# EasyEDA schematic Industrial project work circuits.json
TITLE: Rotary Encoder; REV: 1.0; Date: 2019-01-08; Sheet: 1/1; Drawn By: petrvavra
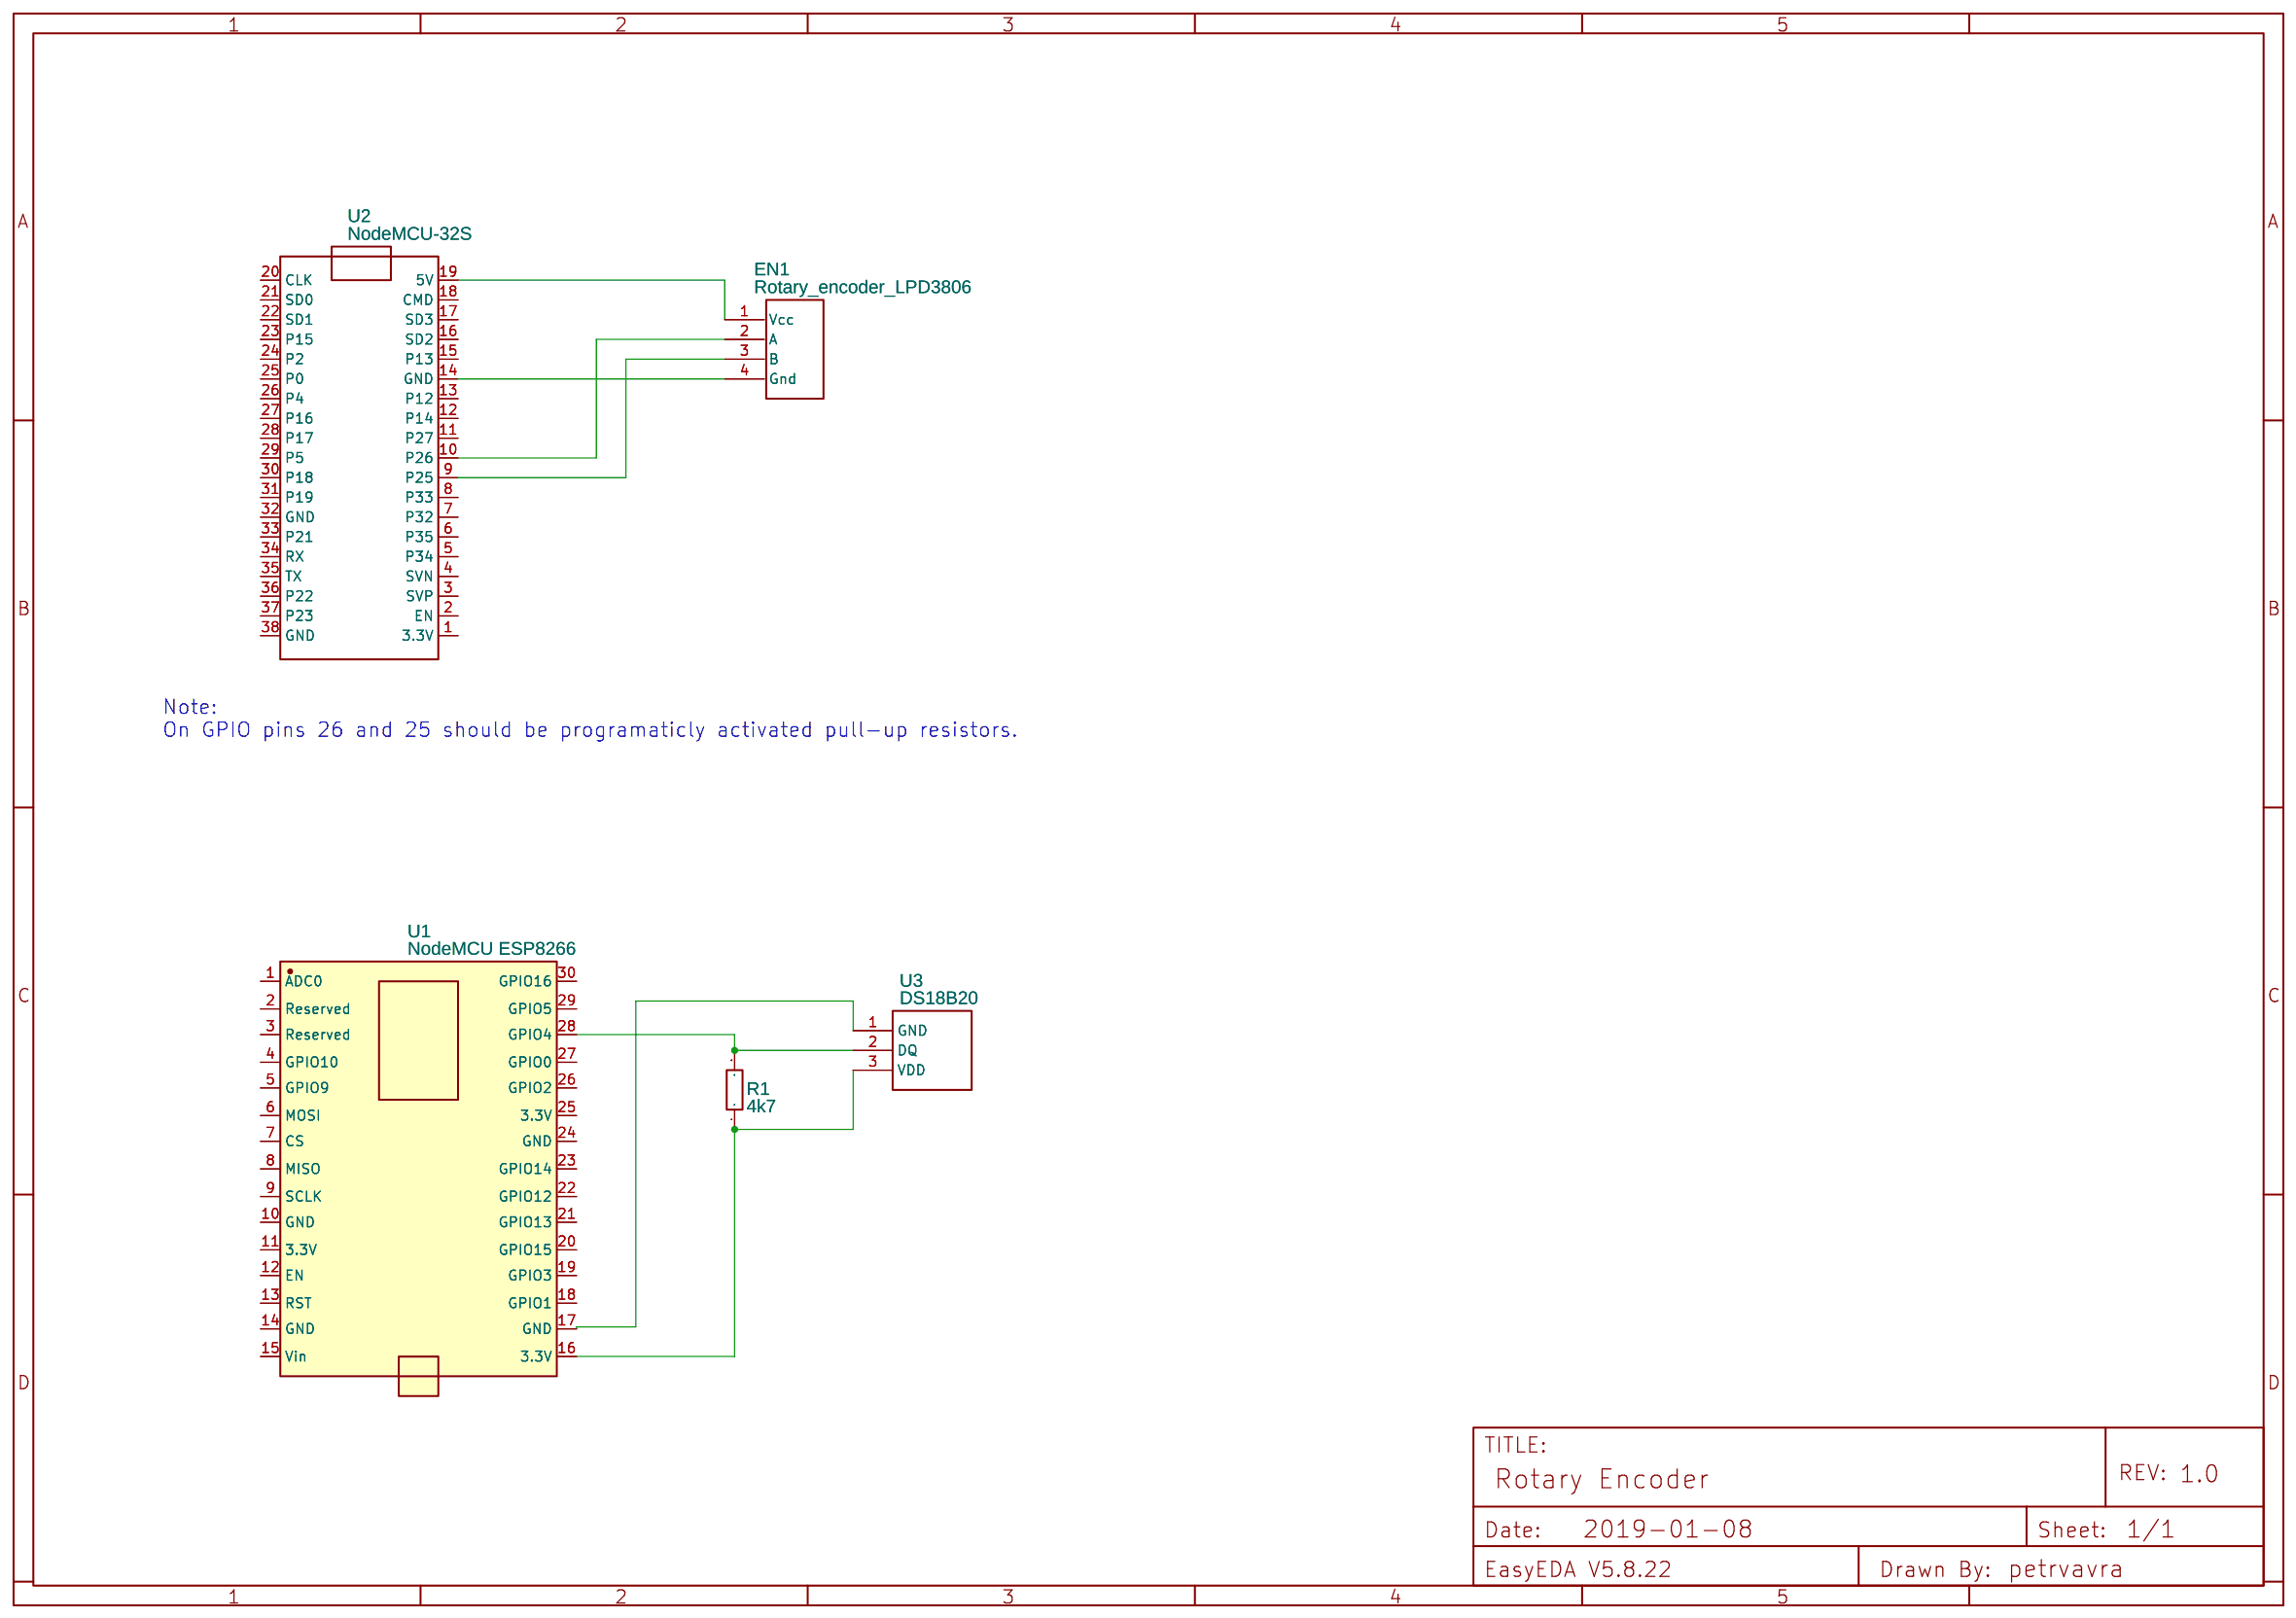
[diagram p0: schematic sheet]

## Parts
EN1  Rotary_encoder_LPD3806  [ROTARY_EMCODER_LIB]
R1  4k7  [AXIAL-0.6]
U1  NodeMCU ESP8266
U2  NodeMCU-32S  [NODEMCU-32S]
U3  DS18B20  [TO-92(TO-92-3)]

## Library data of the parts
EN1 = -: Supplier Part: LPD3806; Supplier: zl3pah; Contributor: zl3pah
R1 = Res_AXIAL-0.6(1W)_EU: Manufacturer Part: ?
U1 = -: Manufacturer Part: New SchematicLib; Contributor: Fynn K
U2 = -: Manufacturer Part: ?
U3 = -: Supplier Part: C9753; Supplier: LCSC; Manufacturer: MAXIM; Manufacturer Part: DS18B20+; image: //image.lceda.cn/szlcsc/C9753.jpg

## Nets
Net-(EN1-1): EN1.1(Vcc) U2.19(5V)
Net-(EN1-2): EN1.2(A) U2.10(P26)
Net-(EN1-3): EN1.3(B) U2.9(P25)
Net-(EN1-4): EN1.4(Gnd) U2.14(GND)
Net-(R1-1): R1.1 U1.16(3.3V) U3.3(VDD)
Net-(R1-2): R1.2 U1.28(GPIO4) U3.2(DQ)
Net-(U1-17): U1.17(GND) U3.1(GND)

Not connected (* = marked no-connect by the designer): U1 1(ADC0) 2(Reserved) 3(Reserved) 4(GPIO10) 5(GPIO9) 6(MOSI) 7(CS) 8(MISO) 9(SCLK) 10(GND) 11(3.3V) 12(EN) 13(RST) 14(GND) 15(Vin) 18(GPIO1) 19(GPIO3) 20(GPIO15) 21(GPIO13) 22(GPIO12) 23(GPIO14) 24(GND) 25(3.3V) 26(GPIO2) 27(GPIO0) 29(GPIO5) 30(GPIO16); U2 1(3.3V) 2(EN) 3(SVP) 4(SVN) 5(P34) 6(P35) 7(P32) 8(P33) 11(P27) 12(P14) 13(P12) 15(P13) 16(SD2) 17(SD3) 18(CMD) 20(CLK) 21(SD0) 22(SD1) 23(P15) 24(P2) 25(P0) 26(P4) 27(P16) 28(P17) 29(P5) 30(P18) 31(P19) 32(GND) 33(P21) 34(RX) 35(TX) 36(P22) 37(P23) 38(GND)

## Notes on the sheet
- Note:
  On GPIO pins 26 and 25 should be programaticly activated pull-up resistors.
